# Altium project master.PrjPcb (part 1 of 2)
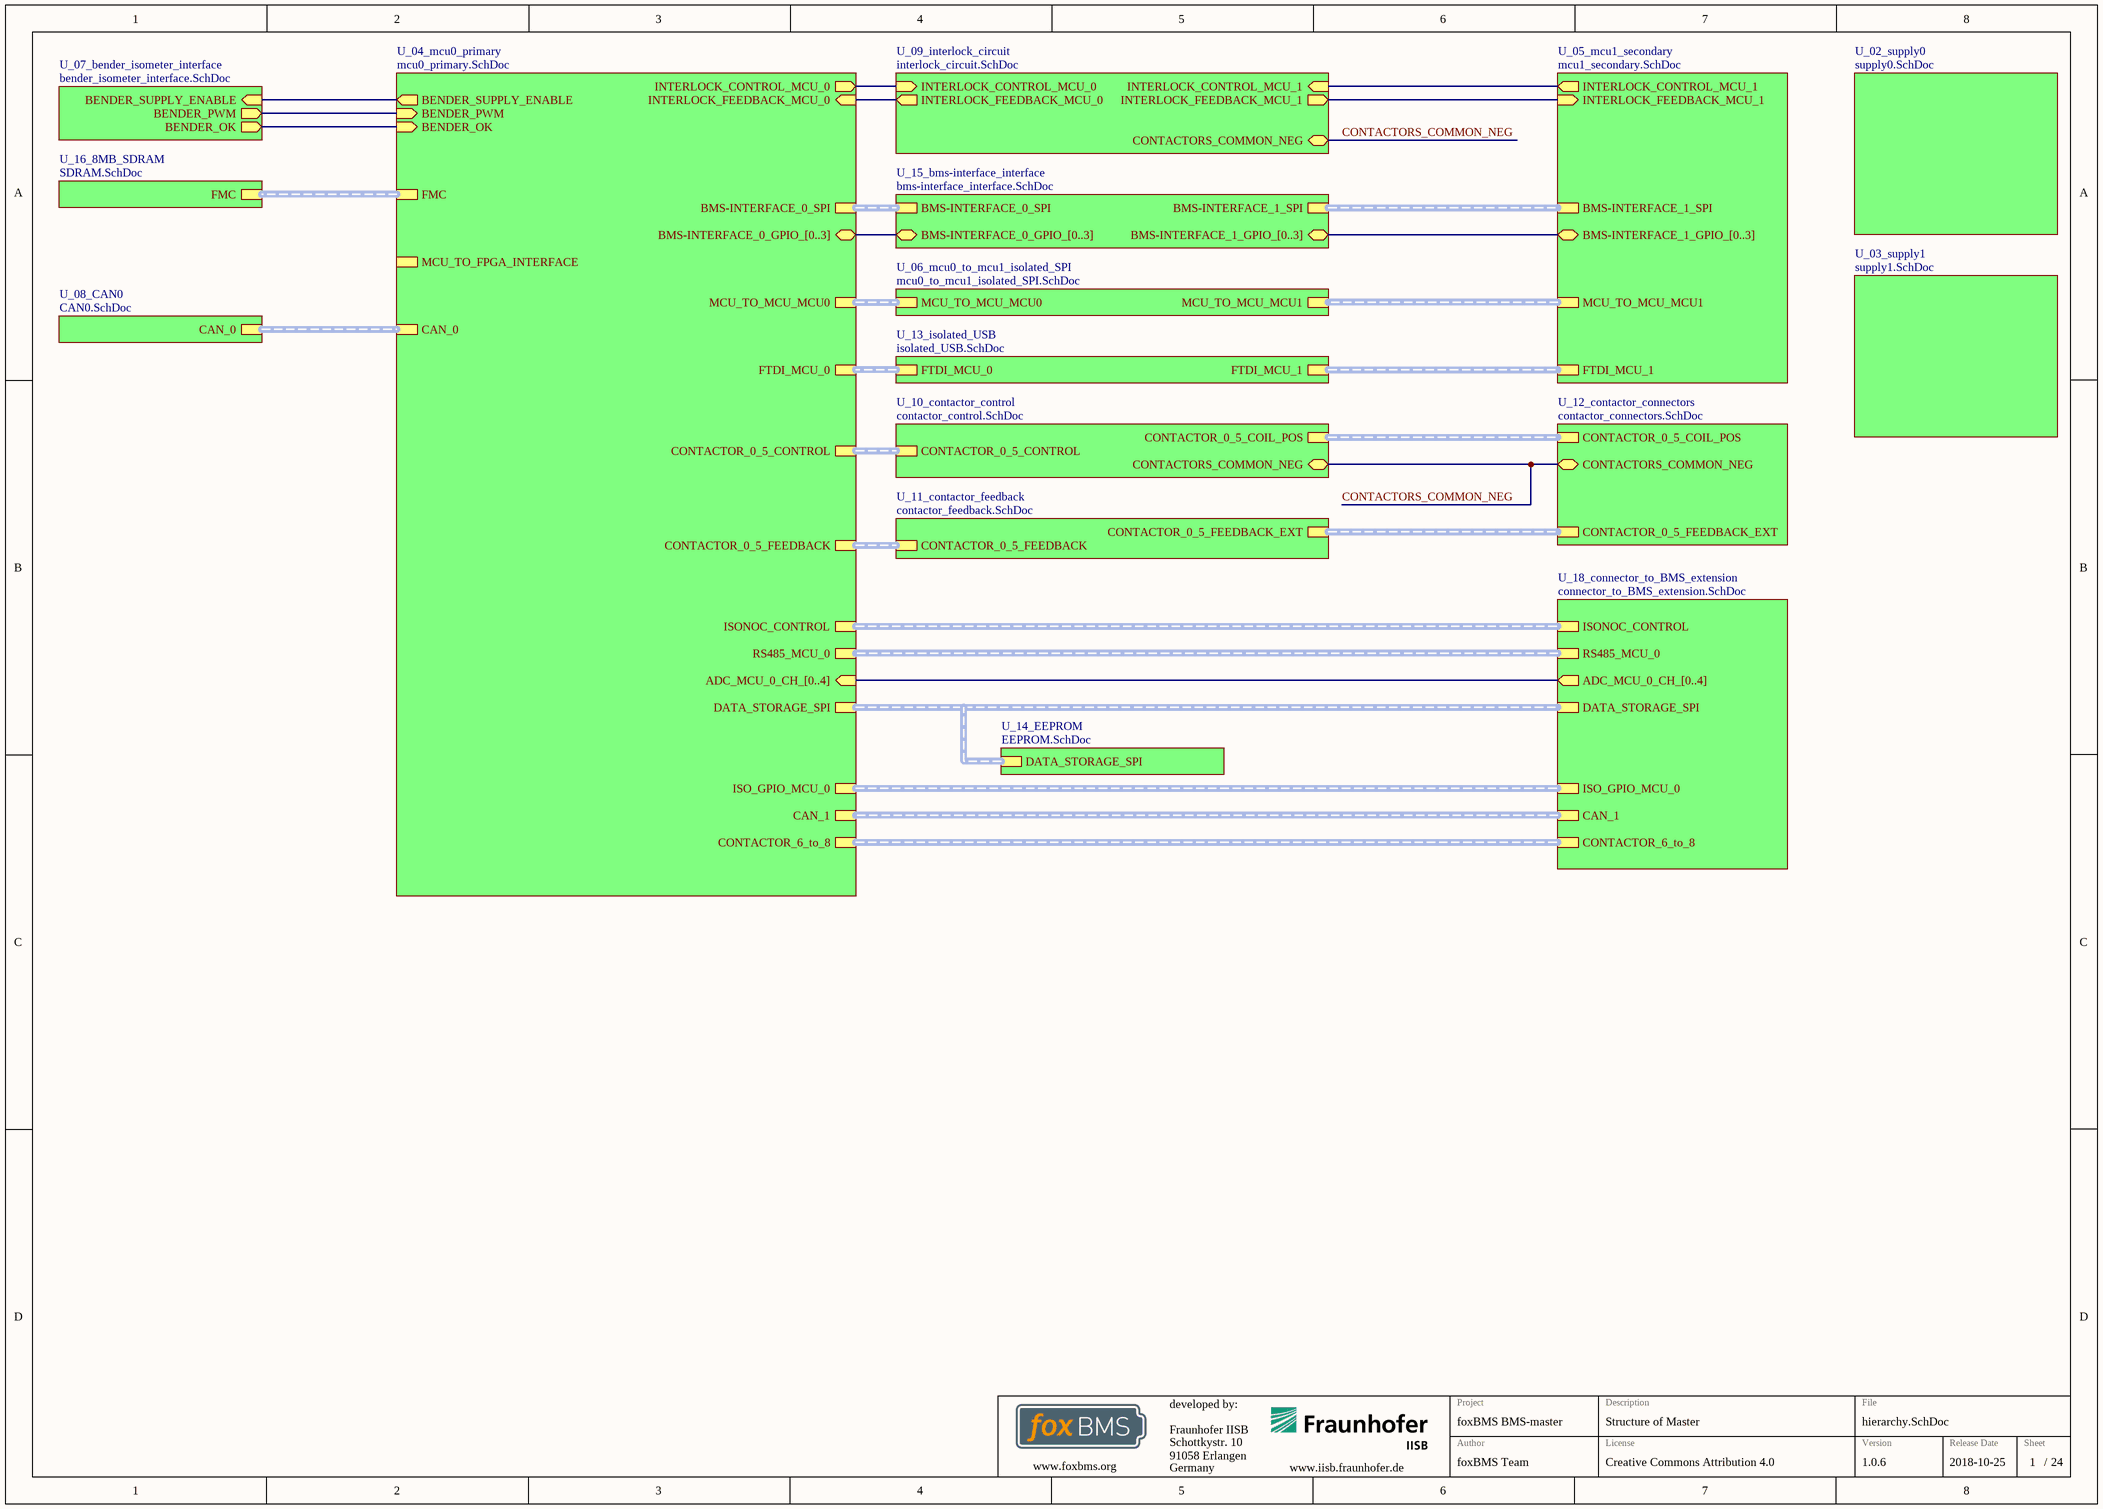
[diagram p0: hierarchy.SchDoc]
GlobalDate: 2018-10-25; GlobalLicense: Creative Commons Attribution 4.0; GlobalProject: foxBMS BMS-master; GlobalVersion: 1.0.6
8 sheets, 124 parts. Net scope: hierarchical (ports join the sheet entries above them; power ports are global).
Board file: master.PcbDoc
Sheets:
  hierarchy.SchDoc
    U_04_mcu0_primary = mcu0_primary.SchDoc
    U_07_bender_isometer_interface = bender_isometer_interface.SchDoc
    U_13_isolated_USB = isolated_USB.SchDoc
    U_05_mcu1_secondary = mcu1_secondary.SchDoc
    U_10_contactor_control = contactor_control.SchDoc
    U_11_contactor_feedback = contactor_feedback.SchDoc
    U_12_contactor_connectors = contactor_connectors.SchDoc

## Sheet hierarchy.SchDoc
size A3; DocumentNumber: 1; SheetNumber: 1; SheetTotal: 24; SheetDescription: Structure of Master

### Sub-sheets
U_02_supply0 = supply0.SchDoc (file not in this document): no entries
U_03_supply1 = supply1.SchDoc (file not in this document): no entries
U_04_mcu0_primary = mcu0_primary.SchDoc: MCU_TO_FPGA_INTERFACE (harness SPI), FMC (harness FMC), CAN_1 (harness CAN), CAN_0 (harness CAN), MCU_TO_MCU_MCU0 (harness SPI), BENDER_SUPPLY_ENABLE (out), BENDER_PWM (in), BENDER_OK (in), FTDI_MCU_0 (harness FTDI), CONTACTOR_6_to_8 (harness CONTACTOR_6_to_8), INTERLOCK_FEEDBACK_MCU_0 (in), INTERLOCK_CONTROL_MCU_0 (out), DATA_STORAGE_SPI (harness DATA_STORAGE_SPI), CONTACTOR_0_5_FEEDBACK (harness CONTACTOR_0_TO_5), CONTACTOR_0_5_CONTROL (harness CONTACTOR_0_TO_5), BMS-INTERFACE_0_SPI (harness SPI), BMS-INTERFACE_0_GPIO_[0..3] (bidir, harness CAN), ADC_MCU_0_CH_[0..4] (in), RS485_MCU_0 (harness RS485), ISONOC_CONTROL (harness ISONOC_CONTROL), ISO_GPIO_MCU_0 (harness ISO_GPIO)
U_05_mcu1_secondary = mcu1_secondary.SchDoc: INTERLOCK_FEEDBACK_MCU_1 (in), INTERLOCK_CONTROL_MCU_1 (out), FTDI_MCU_1 (harness FTDI), MCU_TO_MCU_MCU1 (harness SPI), BMS-INTERFACE_1_SPI (harness SPI), BMS-INTERFACE_1_GPIO_[0..3] (bidir)
U_06_mcu0_to_mcu1_isolated_SPI = mcu0_to_mcu1_isolated_SPI.SchDoc (file not in this document): MCU_TO_MCU_MCU0 (harness SPI), MCU_TO_MCU_MCU1 (harness SPI)
U_07_bender_isometer_interface = bender_isometer_interface.SchDoc: BENDER_SUPPLY_ENABLE (in), BENDER_OK (out), BENDER_PWM (out)
U_08_CAN0 = CAN0.SchDoc (file not in this document): CAN_0 (harness CAN)
U_09_interlock_circuit = interlock_circuit.SchDoc (file not in this document): INTERLOCK_CONTROL_MCU_1 (in), INTERLOCK_FEEDBACK_MCU_0 (out), INTERLOCK_FEEDBACK_MCU_1 (out), CONTACTORS_COMMON_NEG (bidir), INTERLOCK_CONTROL_MCU_0 (in)
U_10_contactor_control = contactor_control.SchDoc: CONTACTORS_COMMON_NEG (bidir), CONTACTOR_0_5_COIL_POS (harness CONTACTOR_0_TO_5), CONTACTOR_0_5_CONTROL (harness CONTACTOR_0_TO_5)
U_11_contactor_feedback = contactor_feedback.SchDoc: CONTACTOR_0_5_FEEDBACK_EXT (harness CONTACTOR_0_TO_5), CONTACTOR_0_5_FEEDBACK (harness CONTACTOR_0_TO_5)
U_12_contactor_connectors = contactor_connectors.SchDoc: CONTACTORS_COMMON_NEG (bidir), CONTACTOR_0_5_COIL_POS (harness CONTACTOR_0_TO_5), CONTACTOR_0_5_FEEDBACK_EXT (harness CONTACTOR_0_TO_5)
U_13_isolated_USB = isolated_USB.SchDoc: FTDI_MCU_0 (harness FTDI), FTDI_MCU_1 (harness FTDI)
U_14_EEPROM = EEPROM.SchDoc (file not in this document): DATA_STORAGE_SPI (harness DATA_STORAGE_SPI)
U_15_bms-interface_interface = bms-interface_interface.SchDoc (file not in this document): BMS-INTERFACE_0_SPI (harness SPI), BMS-INTERFACE_1_SPI (harness SPI), BMS-INTERFACE_0_GPIO_[0..3] (bidir), BMS-INTERFACE_1_GPIO_[0..3] (bidir)
U_16_8MB_SDRAM = SDRAM.SchDoc (file not in this document): FMC (harness FMC)
U_18_connector_to_BMS_extension = connector_to_BMS_extension.SchDoc (file not in this document): CAN_1 (harness CAN), CONTACTOR_6_to_8 (harness CONTACTOR_6_to_8), DATA_STORAGE_SPI (harness DATA_STORAGE_SPI), ADC_MCU_0_CH_[0..4] (out), RS485_MCU_0 (harness RS485), ISONOC_CONTROL (harness ISONOC_CONTROL), ISO_GPIO_MCU_0 (harness ISO_GPIO)

### Nets
BENDER_OK: sheet U_04_mcu0_primary/BENDER_OK, sheet U_07_bender_isometer_interface/BENDER_OK
BENDER_PWM: sheet U_04_mcu0_primary/BENDER_PWM, sheet U_07_bender_isometer_interface/BENDER_PWM
BENDER_SUPPLY_ENABLE: sheet U_04_mcu0_primary/BENDER_SUPPLY_ENABLE, sheet U_07_bender_isometer_interface/BENDER_SUPPLY_ENABLE
CONTACTORS_COMMON_NEG: sheet U_09_interlock_circuit/CONTACTORS_COMMON_NEG, sheet U_10_contactor_control/CONTACTORS_COMMON_NEG, sheet U_12_contactor_connectors/CONTACTORS_COMMON_NEG
INTERLOCK_CONTROL_MCU_0: sheet U_04_mcu0_primary/INTERLOCK_CONTROL_MCU_0, sheet U_09_interlock_circuit/INTERLOCK_CONTROL_MCU_0
INTERLOCK_CONTROL_MCU_1: sheet U_05_mcu1_secondary/INTERLOCK_CONTROL_MCU_1, sheet U_09_interlock_circuit/INTERLOCK_CONTROL_MCU_1
INTERLOCK_FEEDBACK_MCU_0: sheet U_04_mcu0_primary/INTERLOCK_FEEDBACK_MCU_0, sheet U_09_interlock_circuit/INTERLOCK_FEEDBACK_MCU_0
INTERLOCK_FEEDBACK_MCU_1: sheet U_05_mcu1_secondary/INTERLOCK_FEEDBACK_MCU_1, sheet U_09_interlock_circuit/INTERLOCK_FEEDBACK_MCU_1

### Buses and harness runs
bus sheet U_04_mcu0_primary/ADC_MCU_0_CH_[0..4] = sheet U_18_connector_to_BMS_extension/ADC_MCU_0_CH_[0..4]
bus sheet U_05_mcu1_secondary/BMS-INTERFACE_1_GPIO_[0..3] = sheet U_15_bms-interface_interface/BMS-INTERFACE_1_GPIO_[0..3]
harness sheet U_04_mcu0_primary/BMS-INTERFACE_0_SPI = sheet U_15_bms-interface_interface/BMS-INTERFACE_0_SPI
harness sheet U_04_mcu0_primary/CAN_0 = sheet U_08_CAN0/CAN_0
harness sheet U_04_mcu0_primary/CAN_1 = sheet U_18_connector_to_BMS_extension/CAN_1
harness sheet U_04_mcu0_primary/CONTACTOR_0_5_CONTROL = sheet U_10_contactor_control/CONTACTOR_0_5_CONTROL
harness sheet U_04_mcu0_primary/CONTACTOR_0_5_FEEDBACK = sheet U_11_contactor_feedback/CONTACTOR_0_5_FEEDBACK
harness sheet U_04_mcu0_primary/CONTACTOR_6_to_8 = sheet U_18_connector_to_BMS_extension/CONTACTOR_6_to_8
harness sheet U_04_mcu0_primary/DATA_STORAGE_SPI = sheet U_14_EEPROM/DATA_STORAGE_SPI = sheet U_18_connector_to_BMS_extension/DATA_STORAGE_SPI
harness sheet U_04_mcu0_primary/FMC = sheet U_16_8MB_SDRAM/FMC
harness sheet U_04_mcu0_primary/FTDI_MCU_0 = sheet U_13_isolated_USB/FTDI_MCU_0
harness sheet U_04_mcu0_primary/ISO_GPIO_MCU_0 = sheet U_18_connector_to_BMS_extension/ISO_GPIO_MCU_0
harness sheet U_04_mcu0_primary/ISONOC_CONTROL = sheet U_18_connector_to_BMS_extension/ISONOC_CONTROL
harness sheet U_04_mcu0_primary/MCU_TO_MCU_MCU0 = sheet U_06_mcu0_to_mcu1_isolated_SPI/MCU_TO_MCU_MCU0
harness sheet U_04_mcu0_primary/RS485_MCU_0 = sheet U_18_connector_to_BMS_extension/RS485_MCU_0
harness sheet U_05_mcu1_secondary/BMS-INTERFACE_1_SPI = sheet U_15_bms-interface_interface/BMS-INTERFACE_1_SPI
harness sheet U_05_mcu1_secondary/FTDI_MCU_1 = sheet U_13_isolated_USB/FTDI_MCU_1
harness sheet U_05_mcu1_secondary/MCU_TO_MCU_MCU1 = sheet U_06_mcu0_to_mcu1_isolated_SPI/MCU_TO_MCU_MCU1
harness sheet U_10_contactor_control/CONTACTOR_0_5_COIL_POS = sheet U_12_contactor_connectors/CONTACTOR_0_5_COIL_POS
harness sheet U_11_contactor_feedback/CONTACTOR_0_5_FEEDBACK_EXT = sheet U_12_contactor_connectors/CONTACTOR_0_5_FEEDBACK_EXT

### Notes on the sheet
- Fraunhofer IISB
- Schottkystr. 10
- developed by:
- 91058 Erlangen
- Germany
- Author
- Project
- License
- Description
- File
- Version
- Release Date
- Sheet
- www.foxbms.org
- www.iisb.fraunhofer.de
- foxBMS Team
- /

## Sheet mcu0_primary.SchDoc: foxBMS BMS-Master
size A3; DocumentNumber: 4; SheetNumber: 4; SheetTotal: 24; Author: Fraunhofer IISB foxBMS Team; REL-DATE: 2017-05-16; VERSION: 1.0.2; SheetDescription: MCU0 (Primary)
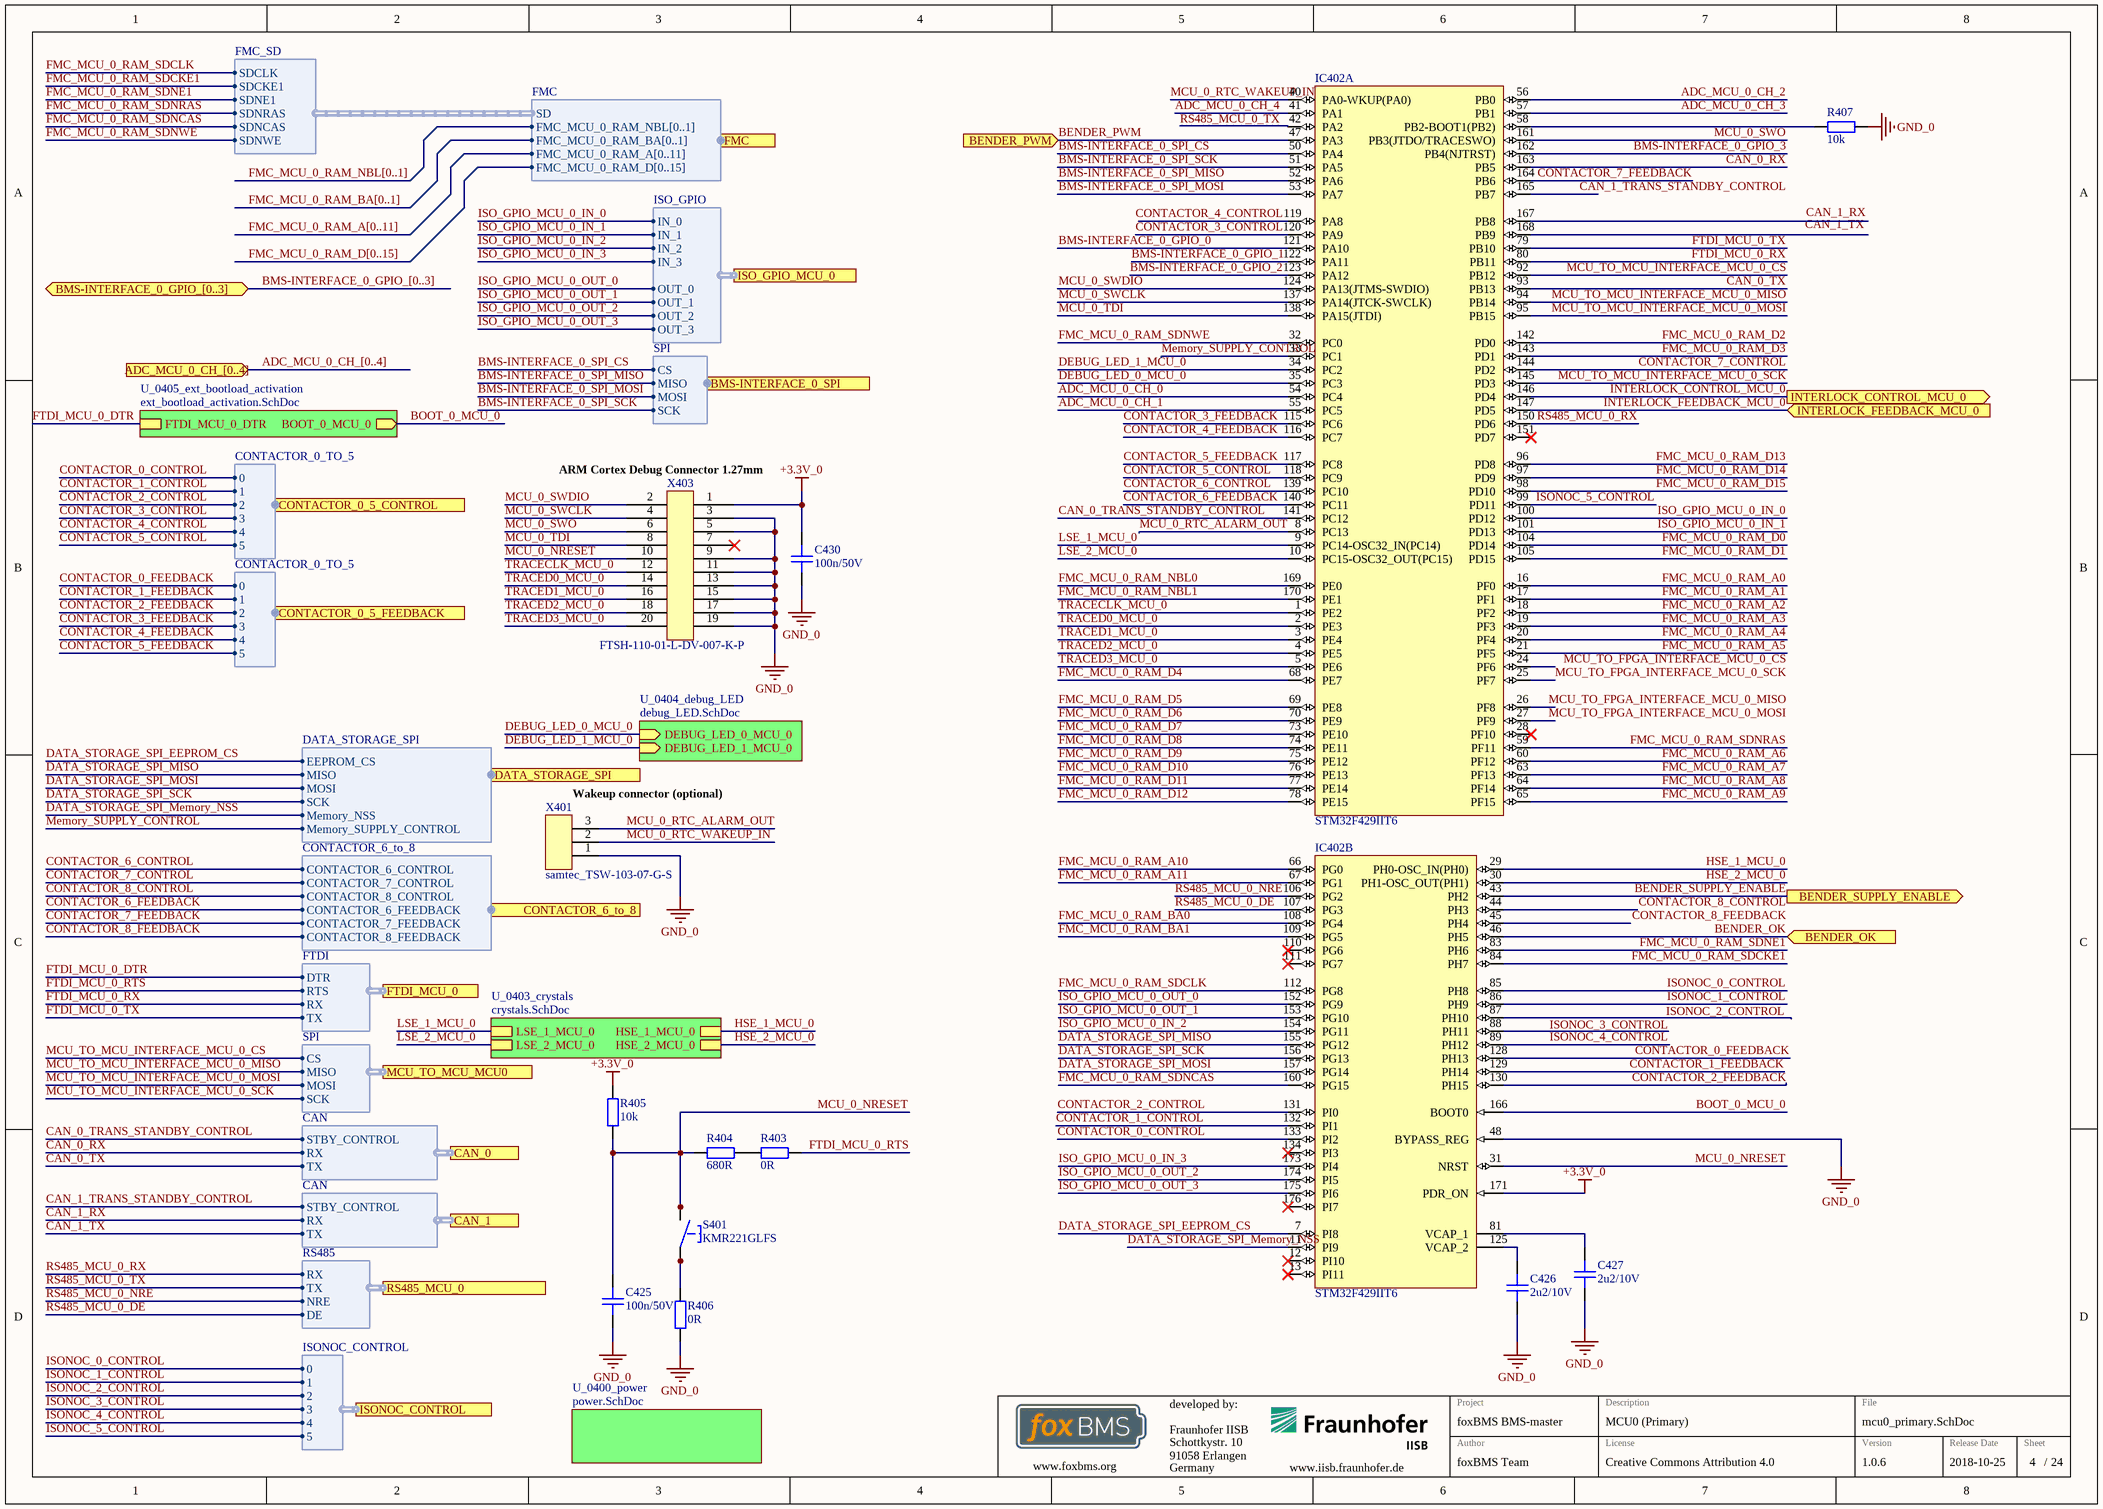
[diagram p1: mcu0_primary.SchDoc]

### Parts
C425  100n/50V  [CAPC1608X08N]
C426  2u2/10V  [CAPC1608X08N]
C427  2u2/10V  [CAPC1608X08N]
C430  100n/50V  [CAPC1608X08N]
IC402  STM32F429IIT6  [STM-LQFP176_N]  (parts A,B of 3)
R403  0R  [RESC1608X05N]
R404  680R  [RESC1608X05N]
R405  10k  [RESC1608X05N]
R406  0R  [RESC1608X05N]
R407  10k  [RESC1608X05N]
S401  KMR221GLFS  [KMR2_Series]
X401  samtec_TSW-103-07-G-S  [Pinheader_2.54_3]
X403  FTSH-110-01-L-DV-007-K-P  [CORTEX_DEBUG_20_PIN]

### Sub-sheets
U_0400_power = power.SchDoc (file not in this document): no entries
U_0403_crystals = crystals.SchDoc (file not in this document): LSE_1_MCU_0, LSE_2_MCU_0, HSE_1_MCU_0, HSE_2_MCU_0
U_0404_debug_LED = debug_LED.SchDoc (file not in this document): DEBUG_LED_0_MCU_0 (in), DEBUG_LED_1_MCU_0 (in)
U_0405_ext_bootload_activation = ext_bootload_activation.SchDoc (file not in this document): FTDI_MCU_0_DTR, BOOT_0_MCU_0 (out)

### Ports
ADC_MCU_0_CH_[0..4] (in), BENDER_OK (in), BENDER_PWM (in), BENDER_SUPPLY_ENABLE (out), BMS-INTERFACE_0_GPIO_[0..3] (bidir, harness CAN), BMS-INTERFACE_0_SPI (harness SPI), CAN_0 (harness CAN), CAN_1 (harness CAN), CONTACTOR_0_5_CONTROL (harness CONTACTOR_0_TO_5), CONTACTOR_0_5_FEEDBACK (harness CONTACTOR_0_TO_5), CONTACTOR_6_to_8 (harness CONTACTOR_6_to_8), DATA_STORAGE_SPI (harness DATA_STORAGE_SPI), FMC (harness FMC), FTDI_MCU_0 (harness FTDI), INTERLOCK_CONTROL_MCU_0 (out), INTERLOCK_FEEDBACK_MCU_0 (in), ISO_GPIO_MCU_0 (harness ISO_GPIO), ISONOC_CONTROL (harness ISONOC_CONTROL), MCU_TO_MCU_MCU0 (harness SPI), RS485_MCU_0 (harness RS485)

### Harnesses
FMC_SD: SDCLK, SDCKE1, SDNE1, SDNRAS, SDNWE, SDNCAS
FMC: SD, FMC_MCU_0_RAM_NBL[0..1], FMC_MCU_0_RAM_BA[0..1], FMC_MCU_0_RAM_A[0..11], FMC_MCU_0_RAM_D[0..15]
DATA_STORAGE_SPI: EEPROM_CS, MISO, MOSI, SCK, Memory_NSS, Memory_SUPPLY_CONTROL
CONTACTOR_6_to_8: CONTACTOR_6_CONTROL, CONTACTOR_7_CONTROL, CONTACTOR_8_CONTROL, CONTACTOR_6_FEEDBACK, CONTACTOR_7_FEEDBACK, CONTACTOR_8_FEEDBACK
SPI: CS, MISO, MOSI, SCK
FTDI: DTR, RTS, RX, TX
CAN: STBY_CONTROL, RX, TX
RS485: RX, TX, NRE, DE
ISONOC_CONTROL: 0, 1, 2, 3, 4, 5
ISO_GPIO: IN_0, IN_1, IN_2, IN_3, OUT_3, OUT_0, OUT_1, OUT_2
CONTACTOR_0_TO_5: 0, 1, 2, 3, 4, 5

### Nets
+3.3V_0: C430.1 IC402.171(PDR_ON) R405.2 X403.1
GND_0: C425.2 C426.2 C427.2 C430.2 IC402.48(BYPASS_REG) R406.1 R407.1 X401.1 X403.3 X403.5 X403.9 X403.11 X403.13 X403.15 X403.17 X403.19
ADC_MCU_0_CH_0: IC402.54(PC4)
ADC_MCU_0_CH_1: IC402.55(PC5)
ADC_MCU_0_CH_2: IC402.56(PB0)
ADC_MCU_0_CH_3: IC402.57(PB1)
ADC_MCU_0_CH_4: IC402.41(PA1)
BENDER_OK: IC402.46(PH5) ; port BENDER_OK
BENDER_PWM: IC402.47(PA3) ; port BENDER_PWM
BENDER_SUPPLY_ENABLE: IC402.43(PH2) ; port BENDER_SUPPLY_ENABLE
BMS-INTERFACE_0_GPIO_0: IC402.121(PA10)
BMS-INTERFACE_0_GPIO_1: IC402.122(PA11)
BMS-INTERFACE_0_GPIO_2: IC402.123(PA12)
BMS-INTERFACE_0_GPIO_3: IC402.162(PB4(NJTRST))
BMS-INTERFACE_0_SPI_CS: IC402.50(PA4) ; port BMS-INTERFACE_0_SPI.CS
BMS-INTERFACE_0_SPI_MISO: IC402.52(PA6) ; port BMS-INTERFACE_0_SPI.MISO
BMS-INTERFACE_0_SPI_MOSI: IC402.53(PA7) ; port BMS-INTERFACE_0_SPI.MOSI
BMS-INTERFACE_0_SPI_SCK: IC402.51(PA5) ; port BMS-INTERFACE_0_SPI.SCK
BOOT_0_MCU_0: IC402.166(BOOT0) ; sheet U_0405_ext_bootload_activation/BOOT_0_MCU_0
CAN_0_RX: IC402.163(PB5) ; port CAN_0.RX
CAN_0_TRANS_STANDBY_CONTROL: IC402.141(PC12) ; port CAN_0.STBY_CONTROL
CAN_0_TX: IC402.93(PB13) ; port CAN_0.TX
CAN_1_RX: port CAN_1.RX
CAN_1_TRANS_STANDBY_CONTROL: port CAN_1.STBY_CONTROL
CAN_1_TX: port CAN_1.TX
CONTACTOR_0_CONTROL: IC402.133(PI2) ; port CONTACTOR_0_5_CONTROL.0
CONTACTOR_0_FEEDBACK: IC402.128(PH13) ; port CONTACTOR_0_5_FEEDBACK.0
CONTACTOR_1_CONTROL: IC402.132(PI1) ; port CONTACTOR_0_5_CONTROL.1
CONTACTOR_1_FEEDBACK: IC402.129(PH14) ; port CONTACTOR_0_5_FEEDBACK.1
CONTACTOR_2_CONTROL: IC402.131(PI0) ; port CONTACTOR_0_5_CONTROL.2
CONTACTOR_3_CONTROL: IC402.120(PA9) ; port CONTACTOR_0_5_CONTROL.3
CONTACTOR_3_FEEDBACK: IC402.115(PC6) ; port CONTACTOR_0_5_FEEDBACK.3
CONTACTOR_4_CONTROL: port CONTACTOR_0_5_CONTROL.4
CONTACTOR_4_FEEDBACK: IC402.116(PC7) ; port CONTACTOR_0_5_FEEDBACK.4
CONTACTOR_5_CONTROL: IC402.118(PC9) ; port CONTACTOR_0_5_CONTROL.5
CONTACTOR_5_FEEDBACK: IC402.117(PC8) ; port CONTACTOR_0_5_FEEDBACK.5
CONTACTOR_6_CONTROL: IC402.139(PC10) ; port CONTACTOR_6_to_8.CONTACTOR_6_CONTROL
CONTACTOR_6_FEEDBACK: IC402.140(PC11) ; port CONTACTOR_6_to_8.CONTACTOR_6_FEEDBACK
CONTACTOR_7_CONTROL: IC402.144(PD2) ; port CONTACTOR_6_to_8.CONTACTOR_7_CONTROL
CONTACTOR_7_FEEDBACK: IC402.164(PB6) ; port CONTACTOR_6_to_8.CONTACTOR_7_FEEDBACK
CONTACTOR_8_CONTROL: port CONTACTOR_6_to_8.CONTACTOR_8_CONTROL
CONTACTOR_8_FEEDBACK: port CONTACTOR_6_to_8.CONTACTOR_8_FEEDBACK
DATA_STORAGE_SPI_EEPROM_CS: IC402.7(PI8) ; port DATA_STORAGE_SPI.EEPROM_CS
DATA_STORAGE_SPI_Memory_NSS: IC402.11(PI9) ; port DATA_STORAGE_SPI.Memory_NSS
DATA_STORAGE_SPI_MISO: IC402.155(PG12) ; port DATA_STORAGE_SPI.MISO
DATA_STORAGE_SPI_MOSI: IC402.157(PG14) ; port DATA_STORAGE_SPI.MOSI
DATA_STORAGE_SPI_SCK: IC402.156(PG13) ; port DATA_STORAGE_SPI.SCK
DEBUG_LED_0_MCU_0: IC402.35(PC3) ; sheet U_0404_debug_LED/DEBUG_LED_0_MCU_0
DEBUG_LED_1_MCU_0: IC402.34(PC2) ; sheet U_0404_debug_LED/DEBUG_LED_1_MCU_0
FMC_MCU_0_RAM_A0: IC402.16(PF0)
FMC_MCU_0_RAM_A1: IC402.17(PF1)
FMC_MCU_0_RAM_A2: IC402.18(PF2)
FMC_MCU_0_RAM_A3: IC402.19(PF3)
FMC_MCU_0_RAM_A4: IC402.20(PF4)
FMC_MCU_0_RAM_A5: IC402.21(PF5)
FMC_MCU_0_RAM_A6: IC402.60(PF12)
FMC_MCU_0_RAM_A7: IC402.63(PF13)
FMC_MCU_0_RAM_A8: IC402.64(PF14)
FMC_MCU_0_RAM_A9: IC402.65(PF15)
FMC_MCU_0_RAM_A10: IC402.66(PG0)
FMC_MCU_0_RAM_A11: IC402.67(PG1)
FMC_MCU_0_RAM_BA0: IC402.108(PG4)
FMC_MCU_0_RAM_BA1: IC402.109(PG5)
FMC_MCU_0_RAM_D0: IC402.104(PD14)
FMC_MCU_0_RAM_D1: IC402.105(PD15)
FMC_MCU_0_RAM_D2: IC402.142(PD0)
FMC_MCU_0_RAM_D3: IC402.143(PD1)
FMC_MCU_0_RAM_D4: IC402.68(PE7)
FMC_MCU_0_RAM_D5: IC402.69(PE8)
FMC_MCU_0_RAM_D6: IC402.70(PE9)
FMC_MCU_0_RAM_D7: IC402.73(PE10)
FMC_MCU_0_RAM_D8: IC402.74(PE11)
FMC_MCU_0_RAM_D9: IC402.75(PE12)
FMC_MCU_0_RAM_D10: IC402.76(PE13)
FMC_MCU_0_RAM_D11: IC402.77(PE14)
FMC_MCU_0_RAM_D12: IC402.78(PE15)
FMC_MCU_0_RAM_D13: IC402.96(PD8)
FMC_MCU_0_RAM_D14: IC402.97(PD9)
FMC_MCU_0_RAM_D15: IC402.98(PD10)
FMC_MCU_0_RAM_NBL0: IC402.169(PE0)
FMC_MCU_0_RAM_NBL1: IC402.170(PE1)
FMC_MCU_0_RAM_SDCKE1: IC402.84(PH7) ; harness FMC_SD.SDCKE1
FMC_MCU_0_RAM_SDCLK: IC402.112(PG8) ; harness FMC_SD.SDCLK
FMC_MCU_0_RAM_SDNCAS: IC402.160(PG15) ; harness FMC_SD.SDNCAS
FMC_MCU_0_RAM_SDNE1: IC402.83(PH6) ; harness FMC_SD.SDNE1
FMC_MCU_0_RAM_SDNRAS: IC402.59(PF11) ; harness FMC_SD.SDNRAS
FMC_MCU_0_RAM_SDNWE: IC402.32(PC0) ; harness FMC_SD.SDNWE
FTDI_MCU_0_DTR: sheet U_0405_ext_bootload_activation/FTDI_MCU_0_DTR, port FTDI_MCU_0.DTR
FTDI_MCU_0_RTS: R403.2 ; port FTDI_MCU_0.RTS
FTDI_MCU_0_RX: IC402.80(PB11) ; port FTDI_MCU_0.RX
FTDI_MCU_0_TX: IC402.79(PB10) ; port FTDI_MCU_0.TX
HSE_1_MCU_0: IC402.29(PH0-OSC_IN(PH0)) ; sheet U_0403_crystals/HSE_1_MCU_0
HSE_2_MCU_0: IC402.30(PH1-OSC_OUT(PH1)) ; sheet U_0403_crystals/HSE_2_MCU_0
INTERLOCK_CONTROL_MCU_0: IC402.146(PD4) ; port INTERLOCK_CONTROL_MCU_0
INTERLOCK_FEEDBACK_MCU_0: IC402.147(PD5) ; port INTERLOCK_FEEDBACK_MCU_0
ISO_GPIO_MCU_0_IN_0: IC402.100(PD12) ; port ISO_GPIO_MCU_0.IN_0
ISO_GPIO_MCU_0_IN_1: IC402.101(PD13) ; port ISO_GPIO_MCU_0.IN_1
ISO_GPIO_MCU_0_IN_2: IC402.154(PG11) ; port ISO_GPIO_MCU_0.IN_2
ISO_GPIO_MCU_0_IN_3: IC402.173(PI4) ; port ISO_GPIO_MCU_0.IN_3
ISO_GPIO_MCU_0_OUT_0: IC402.152(PG9) ; port ISO_GPIO_MCU_0.OUT_0
ISO_GPIO_MCU_0_OUT_1: IC402.153(PG10) ; port ISO_GPIO_MCU_0.OUT_1
ISO_GPIO_MCU_0_OUT_2: IC402.174(PI5) ; port ISO_GPIO_MCU_0.OUT_2
ISO_GPIO_MCU_0_OUT_3: IC402.175(PI6) ; port ISO_GPIO_MCU_0.OUT_3
ISONOC_0_CONTROL: IC402.85(PH8) ; port ISONOC_CONTROL.0
ISONOC_1_CONTROL: IC402.86(PH9) ; port ISONOC_CONTROL.1
ISONOC_2_CONTROL: port ISONOC_CONTROL.2
ISONOC_3_CONTROL: port ISONOC_CONTROL.3
ISONOC_4_CONTROL: IC402.89(PH12) ; port ISONOC_CONTROL.4
ISONOC_5_CONTROL: IC402.99(PD11) ; port ISONOC_CONTROL.5
LSE_1_MCU_0: IC402.9(PC14-OSC32_IN(PC14)) ; sheet U_0403_crystals/LSE_1_MCU_0
LSE_2_MCU_0: IC402.10(PC15-OSC32_OUT(PC15)) ; sheet U_0403_crystals/LSE_2_MCU_0
MCU_0_NRESET: C425.1 IC402.31(NRST) R404.1 R405.1 S401.3 S401.4 X403.10
MCU_0_RTC_ALARM_OUT: IC402.8(PC13) X401.3
MCU_0_RTC_WAKEUP_IN: IC402.40(PA0-WKUP(PA0)) X401.2
MCU_0_SWCLK: IC402.137(PA14(JTCK-SWCLK)) X403.4
MCU_0_SWDIO: IC402.124(PA13(JTMS-SWDIO)) X403.2
MCU_0_SWO: IC402.161(PB3(JTDO/TRACESWO)) X403.6
MCU_0_TDI: IC402.138(PA15(JTDI)) X403.8
MCU_TO_MCU_INTERFACE_MCU_0_CS: IC402.92(PB12) ; port MCU_TO_MCU_MCU0.CS
MCU_TO_MCU_INTERFACE_MCU_0_MISO: IC402.94(PB14) ; port MCU_TO_MCU_MCU0.MISO
MCU_TO_MCU_INTERFACE_MCU_0_MOSI: IC402.95(PB15) ; port MCU_TO_MCU_MCU0.MOSI
MCU_TO_MCU_INTERFACE_MCU_0_SCK: IC402.145(PD3) ; port MCU_TO_MCU_MCU0.SCK
Memory_SUPPLY_CONTROL: IC402.33(PC1) ; port DATA_STORAGE_SPI.Memory_SUPPLY_CONTROL
RS485_MCU_0_DE: IC402.107(PG3) ; port RS485_MCU_0.DE
RS485_MCU_0_NRE: IC402.106(PG2) ; port RS485_MCU_0.NRE
RS485_MCU_0_RX: IC402.150(PD6) ; port RS485_MCU_0.RX
RS485_MCU_0_TX: port RS485_MCU_0.TX
TRACECLK_MCU_0: IC402.1(PE2) X403.12
TRACED0_MCU_0: IC402.2(PE3) X403.14
TRACED1_MCU_0: IC402.3(PE4) X403.16
TRACED2_MCU_0: IC402.4(PE5) X403.18
TRACED3_MCU_0: IC402.5(PE6) X403.20
NetC426_1: C426.1 IC402.125(VCAP_2)
NetC427_1: C427.1 IC402.81(VCAP_1)
NetIC402_58: IC402.58(PB2-BOOT1(PB2)) R407.2
NetR403_1: R403.1 R404.2
NetR406_2: R406.2 S401.1 S401.2

Not connected (* = marked no-connect by the designer): IC402 12(PI10)* 13(PI11)* 24(PF6) 25(PF7) 26(PF8) 27(PF9) 28(PF10)* 42(PA2) 44(PH3) 45(PH4) 87(PH10) 88(PH11) 110(PG6)* 111(PG7)* 119(PA8) 130(PH15) 134(PI3)* 151(PD7)* 165(PB7) 167(PB8) 168(PB9) 176(PI7)*; X403 7*

### Buses and harness runs
bus ADC_MCU_0_CH_[0..4] = port ADC_MCU_0_CH_[0..4]
bus BMS-INTERFACE_0_GPIO_[0..3]
bus FMC_MCU_0_RAM_A[0..11]
bus FMC_MCU_0_RAM_BA[0..1]
bus FMC_MCU_0_RAM_D[0..15]
bus FMC_MCU_0_RAM_NBL[0..1]

### Notes on the sheet
- (near X403) ARM Cortex Debug Connector 1.27mm
- (near X401) Wakeup connector (optional)
- Labels drawn without touching a wire or pin: CAN_1_RX, CAN_1_TRANS_STANDBY_CONTROL, CAN_1_TX, CONTACTOR_2_FEEDBACK, CONTACTOR_4_CONTROL, CONTACTOR_8_CONTROL, CONTACTOR_8_FEEDBACK, ISONOC_2_CONTROL, ISONOC_3_CONTROL, MCU_TO_FPGA_INTERFACE_MCU_0_CS, MCU_TO_FPGA_INTERFACE_MCU_0_MISO, MCU_TO_FPGA_INTERFACE_MCU_0_MOSI, MCU_TO_FPGA_INTERFACE_MCU_0_SCK, RS485_MCU_0_TX
- Fraunhofer IISB
- Schottkystr. 10
- developed by:
- 91058 Erlangen
- Germany
- Author
- Project
- License
- Description
- File
- Version
- Release Date
- Sheet
- www.foxbms.org
- www.iisb.fraunhofer.de
- foxBMS Team
- /

### Library data of the parts
C425 C430 = gen_C_ceramic_100n_50V_X7R_0603: MLCC; Capacitance: 100n; Rated Voltage: 50V; Dielectric: X7R; Case EIA: 0603; Case Metric: 1608; PnP Package: C_0603_10; PnP Value: 100n/50V/X7R; PnP equipped: x; Automotive Qualified: False; Part Number: gen_C_ceramic_100n_50V_X7R_0603; Supplier 1: Farnell; Supplier Part Number 1: 2525267; Supplier 2: Digikey; Supplier Part Number 2: 490-6049-1-ND
C426 C427 = gen_C_ceramic_2u2_10V_X5R_0603: MLCC; Capacitance: 2u2; Rated Voltage: 10V; Dielectric: X5R; Case EIA: 0603; Case Metric: 1608; AVT Set: x; Automotive Qualified: False; Part Number: gen_C_ceramic_2u2_10V_X5R_0603; Supplier 1: Farnell; Supplier Part Number 1: 2320817
IC402 = CMP-0243-00078-2: ARM Cortex-M4 32-bit MCU+FPU, 225 DMIPS, 2048 kB Flash, 256 kB Internal RAM, 140 I/Os, 176-pin LQFP, -40 to 85 degC, Tray; Manufacturer: STMicroelectronics; Internal RAM Size (kB): 256; I/Os (High Current): 140; FLASH Size (Prog) (kB): 2048; D/A Converter: 2x12-bit; Supply Voltage(Vcc) max (V): 3.6; Operating Frequency(F) (Processor speed) (MHz): 180; Supply Voltage(Vcc) min (V): 1.8; Core: ARM Cortex-M4; PackageReference: LQFP176; ComponentLink1Description: Manufacturer URL; Packing: Tray; ComponentLink2Description: Datasheet; ComponentLink3Description: Package Specification; ComponentLink2URL: http://www.st.com/st-web-ui/static/active/en/resource/technical/document/data_brief/DM00053488.pdf; PackageVersion: Rev. 4, 06/2013; ComponentLink1URL: http://www.st.com/web/en/home.html; DatasheetVersion: Rev. 2; PartNumber: STM32F429IIT6; PackageDescription: 176-Pin Low Profile Quad Flat Package, 24 x 24 mm Body, 0.5 mm Pitch; ComponentLink3URL: http://www.st.com/st-web-ui/static/active/en/resource/technical/document/datasheet/DM00035129.pdf; Mounting Technology: Surface Mount
R403 R406 = gen_R_0R_0603: SMD Resistor 0R 0603; Power: 0.1W; Case EIA: 0603; Case Metric: 1608; PnP Package: R_0603; Maximum Working Voltage: 75V; Automotive Qualified: False; Part Number: gen_R_0R_0603; Operating Temperature: -55°C - +155°C; Resistance: 0R; Series: Jumper; PnP Value: 0R; Supplier 1: Farnell; Supplier Part Number 1: 2073345
R404 = gen_R_680R_0603: SMD Resistor 680R 0603; Tolerance: 1%; Power: 0.1W; Case EIA: 0603; Case Metric: 1608; Maximum Working Voltage: 75V; PnP Package: R_0603; Automotive Qualified: False; Part Number: gen_R_680R_0603; Operating Temperature: -55°C - +155°C; Resistance: 680R; Series: E24; PnP Value: 680R; Supplier 1: Farnell; Supplier Part Number 1: 2797303
R405 R407 = gen_R_10k_0603: SMD Resistor 10k 0603; Tolerance: 1%; Power: 0.1W; Case EIA: 0603; Case Metric: 1608; Maximum Working Voltage: 75V; PnP Package: R_0603; Automotive Qualified: False; Part Number: gen_R_10k_0603; Operating Temperature: -55°C - +155°C; Resistance: 10k; Series: E24, E96; PnP Value: 10k; Supplier 1: Farnell; Supplier Part Number 1: 2073349
S401 = KMR221GLFS: Microminiature Tactile Switch; Manufacturer: CK Components; Automotive Qualified: False; Part Number: KMR221GLFS; Operating Temperature: -40°C - +85°C; ComponentLink1Description: Datasheet; ComponentLink1URL: http://www.farnell.com/datasheets/1685525.pdf; Supplier 1: Farnell; Supplier Part Number 1: 1201424; Supplier 2: Digikey; Supplier Part Number 2: 401-1426-1-ND; Supplier 3: Mouser; Supplier Part Number 3: 611-KMR211G-LFS
X401 = samtec_TSW-103-07-G-S: Board-To-Board Connector, Vertical, 2.54 mm, 3 Contacts, Header, TSW Series, Through Hole, 1 Row; Manufacturer: Samtec; Circuits: 3; Automotive Qualified: False; Part Number: samtec_TSW-103-07-G-S; Part Name: TSW-103-07-G-S; Operating Temperature: -55°C - +125°C; ComponentLink1Description: Datasheet; ComponentLink1URL: http://www.farnell.com/datasheets/1796313.pdf; Supplier 1: Farnell; Supplier Part Number 1: 2505045
X403 = samtec_FTSH-110-01-L-DV-007-K-P: Board-To-Board Connector, ARM Cortex Debug Header 20 Pin; Manufacturer: Samtec; Circuits: 20; Automotive Qualified: False; Part Number: samtec_FTSH-110-01-L-DV-007-K-P; Part Name: FTSH-110-01-L-DV-007-K-P; Operating Temperature: -55°C - +125°C; Supplier 1: Digikey; Supplier Part Number 1: SAM11268-ND; Supplier 2: Avnet; Supplier Part Number 2: FTSH-110-01-L-DV-007-K-P

## Sheet bender_isometer_interface.SchDoc: foxBMS BMS-Master
size A3; DocumentNumber: 13; SheetNumber: 13; SheetTotal: 24; Author: Fraunhofer IISB foxBMS Team; REL-DATE: 2017-05-16; VERSION: 1.0.2; SheetDescription: Bender Isometer Interface
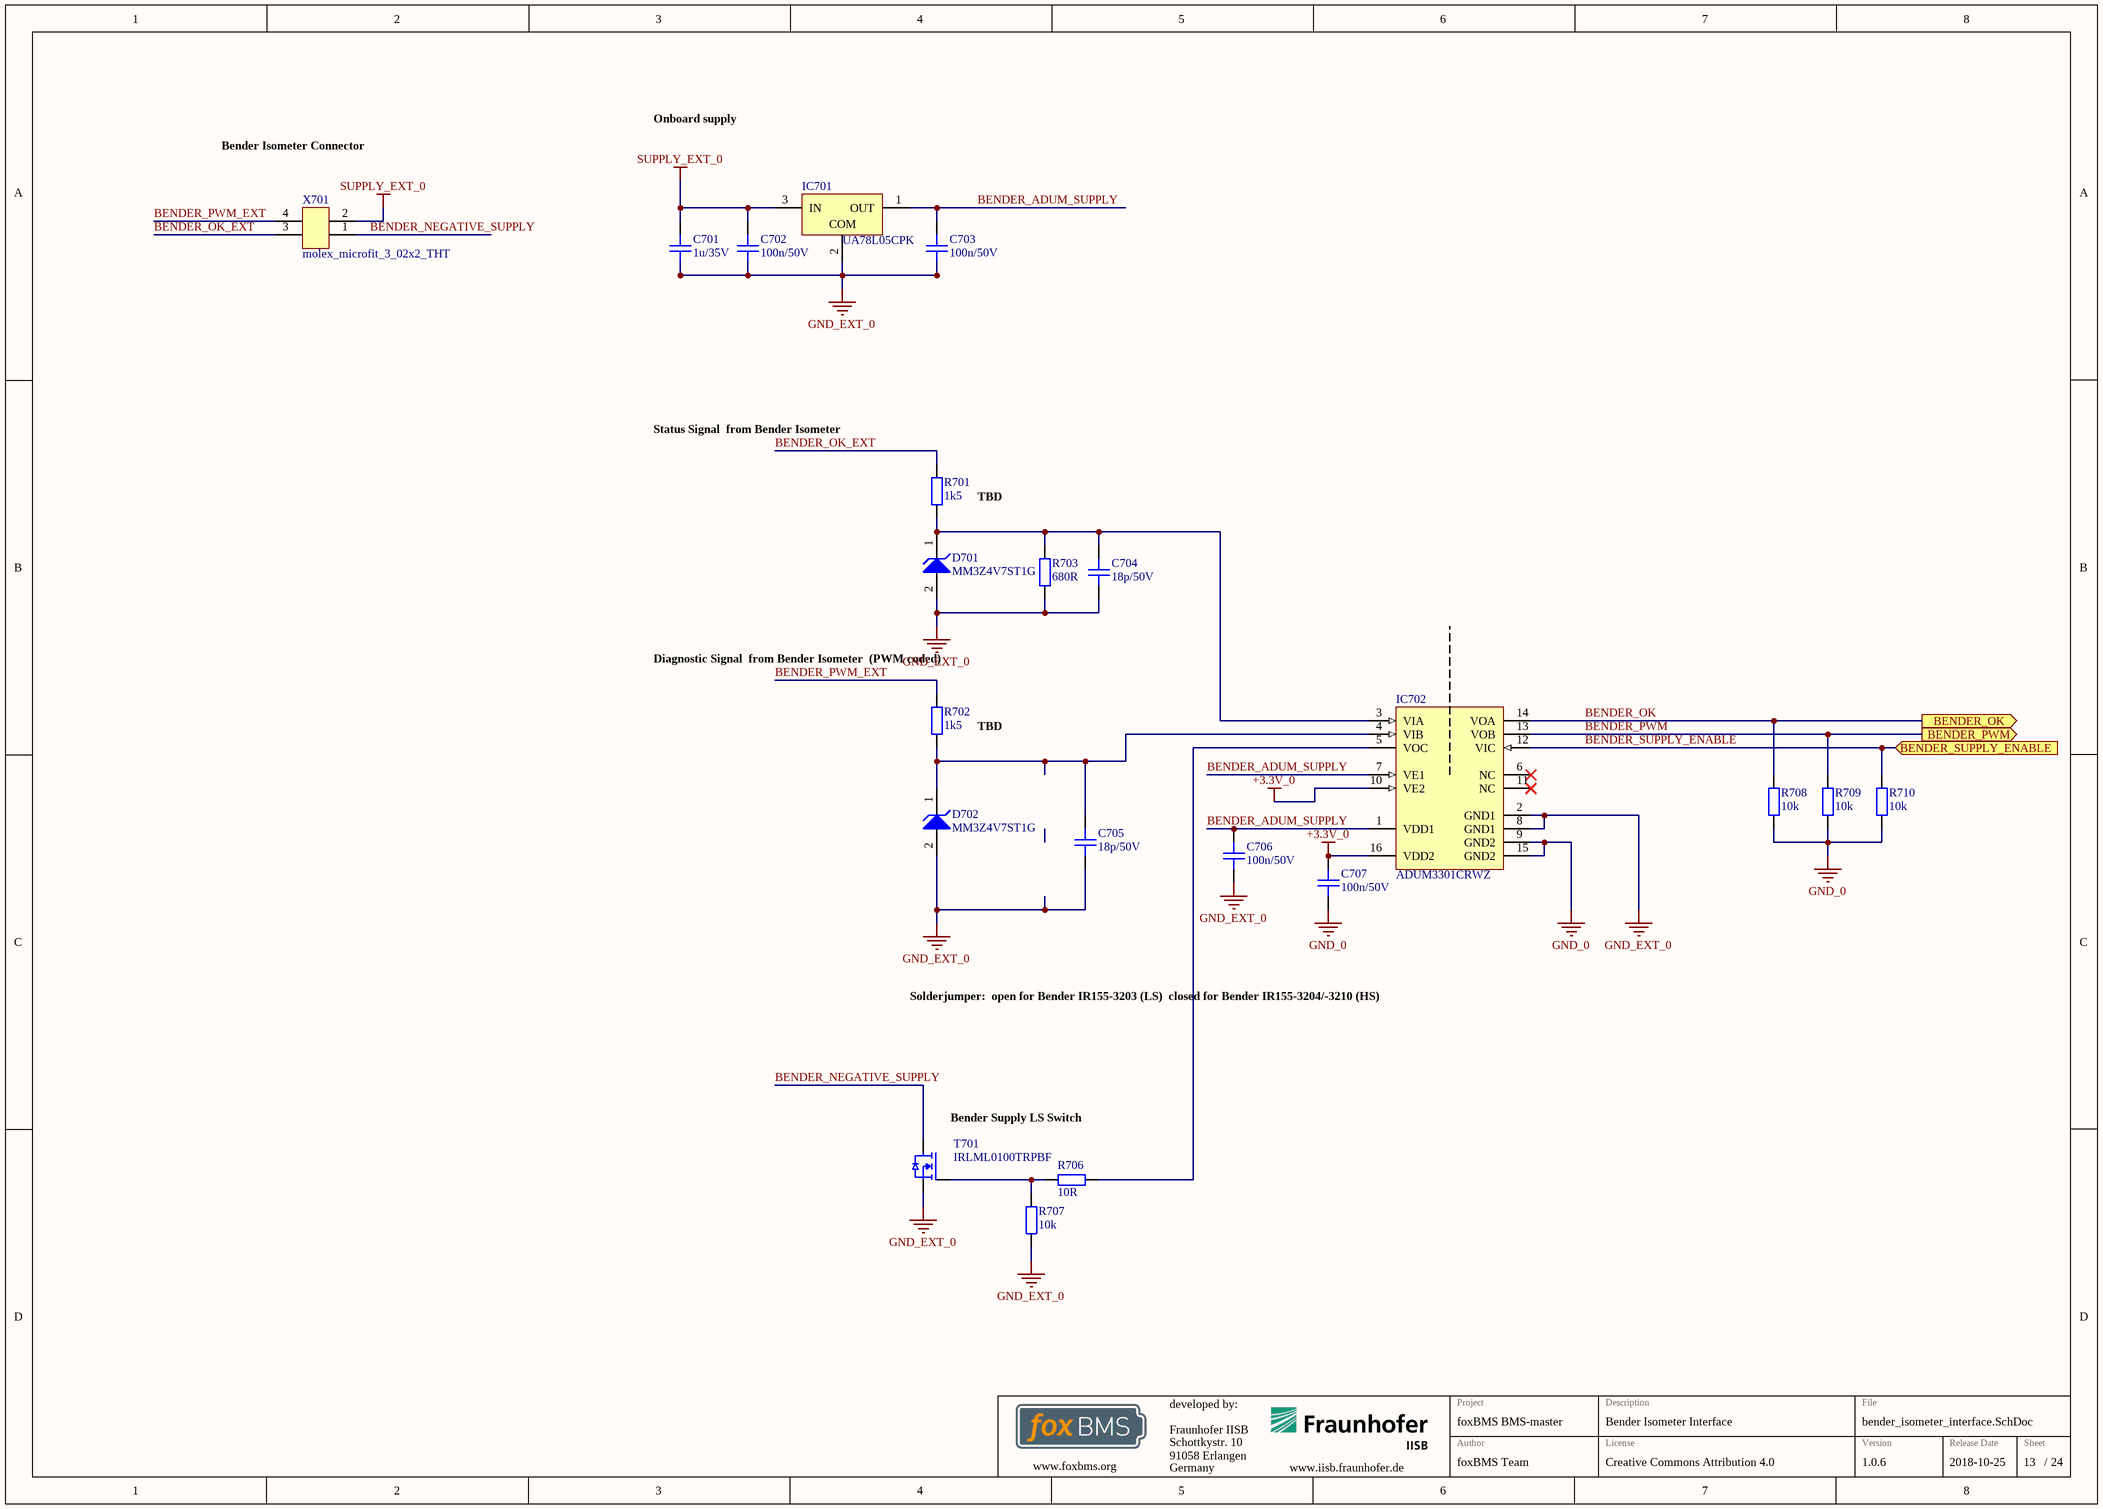
[diagram p2: bender_isometer_interface.SchDoc]

### Parts
C701  1u/35V  [CAPC1608X08N]
C702  100n/50V  [CAPC1608X08N]
C703  100n/50V  [CAPC1608X08N]
C704  18p/50V  [CAPC1608X08N]
C705  18p/50V  [CAPC1608X08N]
C706  100n/50V  [CAPC1608X08N]
C707  100n/50V  [CAPC1608X08N]
D701  MM3Z4V7ST1G  [ONSC-SOD-323-2-477-02_V]
D702  MM3Z4V7ST1G  [ONSC-SOD-323-2-477-02_V]
IC701  UA78L05CPK  [PK0003A_L]
IC702  ADUM3301CRWZ  [ADI-RW-16_N]
R701  1k5  [RESC1608X05N]
R702  1k5  [RESC1608X05N]
R703  680R  [RESC1608X05N]
R706  10R  [RESC1608X05N]
R707  10k  [RESC1608X05N]
R708  10k  [RESC1608X05N]
R709  10k  [RESC1608X05N]
R710  10k  [RESC1608X05N]
T701  IRLML0100TRPBF  [SOT95P237X110-3N]
X701  molex_microfit_3_02x2_THT  [MOLEX_MICROFIT_02x2_THT]

### Ports
BENDER_OK (out), BENDER_PWM (out), BENDER_SUPPLY_ENABLE (in)

### Nets
+3.3V_0: C707.1 IC702.10(VE2) IC702.16(VDD2)
GND_0: C707.2 IC702.9(GND2) IC702.15(GND2) R708.1 R709.1 R710.1
GND_EXT_0: C701.2 C702.2 C703.2 C704.2 C705.2 C706.2 D701.2(A) D702.2(A) IC701.2(COM) IC702.2(GND1) IC702.8(GND1) R703.1 R707.2 T701.S
SUPPLY_EXT_0: C701.1 C702.1 IC701.3(IN) X701.2
BENDER_ADUM_SUPPLY: C703.1 C706.1 IC701.1(OUT) IC702.1(VDD1) IC702.7(VE1)
BENDER_NEGATIVE_SUPPLY: T701.D X701.1
BENDER_OK: IC702.14(VOA) R708.2 ; port BENDER_OK
BENDER_OK_EXT: R701.2 X701.3
BENDER_PWM: IC702.13(VOB) R709.2 ; port BENDER_PWM
BENDER_PWM_EXT: R702.2 X701.4
BENDER_SUPPLY_ENABLE: IC702.12(VIC) R710.2 ; port BENDER_SUPPLY_ENABLE
NetC704_1: C704.1 D701.1(K) IC702.3(VIA) R701.1 R703.2
NetC705_1: C705.1 D702.1(K) IC702.4(VIB) R702.1
NetIC702_5: IC702.5(VOC) R706.1
NetR706_2: R706.2 R707.1 T701.G

Not connected (* = marked no-connect by the designer): IC702 6(NC)* 11(NC)*

### Notes on the sheet
- Bender Isometer Connector
- Onboard supply
- Status Signal
  from Bender Isometer
- (near R701) TBD
- (near R702) Diagnostic Signal
  from Bender Isometer
  (PWM coded)
- (near R702) TBD
- Solderjumper:
  open for Bender IR155-3203 (LS)
  closed for Bender IR155-3204/-3210 (HS)
- (near T701) Bender Supply LS Switch
- Fraunhofer IISB
- Schottkystr. 10
- developed by:
- 91058 Erlangen
- Germany
- Author
- Project
- License
- Description
- File
- Version
- Release Date
- Sheet
- www.foxbms.org
- www.iisb.fraunhofer.de
- foxBMS Team
- /

### Library data of the parts
C701 = gen_C_ceramic_1u_35V_X7R_0603: MLCC; Capacitance: 1u; Rated Voltage: 35V; Dielectric: X7R; Case EIA: 0603; Case Metric: 1608; PnP Package: C_0603_10; PnP Value: 1uF/35V/X7R; PnP equipped: x; Automotive Qualified: False; Part Number: gen_C_ceramic_1u_35V_X7R_0603; Supplier 1: Farnell; Supplier Part Number 1: 1907508
C702 C703 C706 C707 = gen_C_ceramic_100n_50V_X7R_0603: as C425 on sheet mcu0_primary; Part Number: gen_C_ceramic_100n_50V_X7R_0603; Supplier 1: Farnell; Supplier Part Number 1: 2525267; Supplier 2: Digikey; Supplier Part Number 2: 490-6049-1-ND
C704 C705 = gen_C_ceramic_18p_50V_C0G_0603: MLCC; Capacitance: 18p; Rated Voltage: 50V; Dielectric: C0G; Case EIA: 0603; Case Metric: 1608; Automotive Qualified: False; Part Number: gen_C_ceramic_18p_50V_C0G_0603; Supplier 1: Farnell; Supplier Part Number 1: 2070403
D701 D702 = CMP-1060-00697-1: Zener Voltage Regulator, 300 mW, Tight Tolerance Portfolio, 2-Pin SOD-323, Pb-Free, Tape and Reel; Manufacturer: On Semiconductor; P Max (W): 0.3; ComponentLink2Description: Datasheet; PackageDescription: 2-Pin SOD, Body 1.7 x 1.25 mm; PartNumber: MM3Z4V7ST1G; ComponentLink2URL: http://www.onsemi.cn/pub_link/Collateral/MM3Z2V4ST1-D.PDF; ComponentLink1Description: Manufacturer URL; DatasheetVersion: Rev. 21; PackageReference: SOD-323-2-477-02; ComponentLink3URL: http://www.onsemi.com/pub_link/Collateral/477-02.PDF.1; RoHS: Pb-Free; ComponentLink3Description: Package Specification; ComponentLink1URL: http://www.onsemi.com/; Packing: Tape and Reel; Mounting Technology: Surface Mount; PackageVersion: Rev. H, 03/2007
IC701 = CMP-2000-07341-1: Positive-Voltage Regulator, 100 mA, 0 to 125 degC, 3-Pin SOT-89 (PK), Green (RoHS & no Sb/Br), Tape and Reel; Manufacturer: TexasInstruments; Load Regulation: 60mV; Input Voltage MIN: 7V; Number of Outputs: 1; Input Voltage MAX: 20V; Output Type: Fixed; Output Current: 100mA; Output Voltage: 5V; PSRR / Ripple Rejection - Typ: 49dB; Line Regulation: 200mV; Mounting Style: SMD/SMT; Datasheet Version: Rev. U, 05/2011; Polarity: Positive; Minimum Operating Temperature: 0C; Package Reference: PK0003A; Brand: TexasInstruments; Packaging: Reel; Product Category: LinearVoltageRegulators; RoHS: True; Datasheet URL: http://www.ti.com/lit/ds/symlink/ua78l05.pdf; Package URL: http://www.ti.com/lit/ml/mhsi001b/mhsi001b.pdf; Series: UA78L05; Manufacturer URL: http://www.ti.com/; Package Description: 3-Pin Small Outline Transistor, Body 4.5 x 2.5 mm, Pitch 1.5 mm; Mounting Technology: SurfaceMount; Package / Case: SOT-89-4; Maximum Operating Temperature: +125C
IC702 = CMP-0534-00610-1: Triple Channel Digital Isolator, Enhanced System-Level ESD Reliability, 2.5 KV rms Insulation Rating, 90 Mbps Data Rate, 32 ns Delay, Industrial, 16-pin SOIC (RW-16), Tube; Manufacturer: Analog Devices; Insulation Rating (kVrms): 2.5; Max Data Rate: 90Mbps; PackageVersion: 032707-B, 03/2007; PartNumber: ADUM3301CRWZ; PackageDescription: 16-Pin Standard Small Outline Package, Body 10.3 x 7.5 mm, Pitch 1.27 mm; Max Operating Temp (degreesC): 105; PackageReference: RW-16; Code_JEDEC: MS-013-AA; ComponentLink1URL: http://www.analog.com/en/index.html; ComponentLink2URL: http://www.analog.com/static/imported-files/data_sheets/ADUM3300_3301.pdf; ComponentLink1Description: Manufacturer URL; ComponentLink4URL: Product URL:http://www.analog.com/en/interface-isolation/digital-isolators/adum3301/products/product.html; ComponentLink4Description: URL Link1; DatasheetVersion: Rev. B; ComponentLink3URL: http://www.analog.com/static/imported-files/packages/PKG_PDF/SOIC_WIDE%20%28RW%29/RW_16.pdf; ComponentLink3Description: Package Specification; Mounting Technology: Surface Mount; ComponentLink2Description: Datasheet
R701 R702 = gen_R_1k5_0603: SMD Resistor 1k5 0603; Tolerance: 1%; Power: 0.1W; Case EIA: 0603; Case Metric: 1608; Maximum Working Voltage: 75V; PnP Package: R_0603; Automotive Qualified: False; Part Number: gen_R_1k5_0603; Operating Temperature: -55°C - +155°C; Resistance: 1k5; Series: E24, E96; PnP Value: 1k5; Supplier 1: Farnell; Supplier Part Number 1: 2616745
R703 = gen_R_680R_0603: as R404 on sheet mcu0_primary; Part Number: gen_R_680R_0603; Operating Temperature: -55°C - +155°C; Resistance: 680R; Series: E24; PnP Value: 680R; Supplier 1: Farnell; Supplier Part Number 1: 2797303
R706 = gen_R_10R_0603: SMD Resistor 10R 0603; Tolerance: 1%; Power: 0.1W; Case EIA: 0603; Case Metric: 1608; Maximum Working Voltage: 75V; PnP Package: R_0603; Automotive Qualified: False; Part Number: gen_R_10R_0603; Operating Temperature: -55°C - +155°C; Resistance: 10R; Series: E24, E96; PnP Value: 10R; Supplier 1: Farnell; Supplier Part Number 1: 2073361
R707-R710 = gen_R_10k_0603: as R405 on sheet mcu0_primary; Part Number: gen_R_10k_0603; Operating Temperature: -55°C - +155°C; Resistance: 10k; Series: E24, E96; PnP Value: 10k; Supplier 1: Farnell; Supplier Part Number 1: 2073349
T701 = IRLML0100TRPBF: MOSFET-Transistor, n-Kanal, 1.6 A, 100 V, 0.178 ohm, 10 V, 2.5 V; Manufacturer: Infineon; Maximum Drain-Source Voltage: 100V; Maximum Continous Drain Current (25°C): 1.6A; R_DS(on): 190m; Total Gate Charge: 2.5nC; Automotive Qualified: False; Part Number: IRLML0100TRPBF; Part Name: NMOS; Operating Temperature: -55°C - +150°C; ComponentLink1Description: Datasheet URL; ComponentLink1URL: http://www.farnell.com/datasheets/491501.pdf; Supplier 1: Farnell; Supplier Part Number 1: 1783928
X701 = molex_microfit_3_02x2_THT: Micro-Fit 3.0 Right Angle Header, 3.00mm Pitch, Dual Row, 4 Circuits, with Snap-in Plastic Peg PCB Lock, Tin, Glow Wire Capable, Black, 43045-0400; Manufacturer: Molex; Circuits: 4; Rated Voltage: 600V; Rated Current: 8.5A; Automotive Qualified: False; Part Number: molex_microfit_3_02x2_THT; Part Name: MicroFit; Operating Temperature: -40°C - +105°C; Supplier 1: Farnell; Supplier Part Number 1: 9733019

## Sheet isolated_USB.SchDoc: foxBMS BMS-Master
size A3; DocumentNumber: 19; SheetNumber: 19; SheetTotal: 24; Author: Fraunhofer IISB foxBMS Team; REL-DATE: 2017-05-16; VERSION: 1.0.2; SheetDescription: Isolated USB MCU_0 + MCU_1
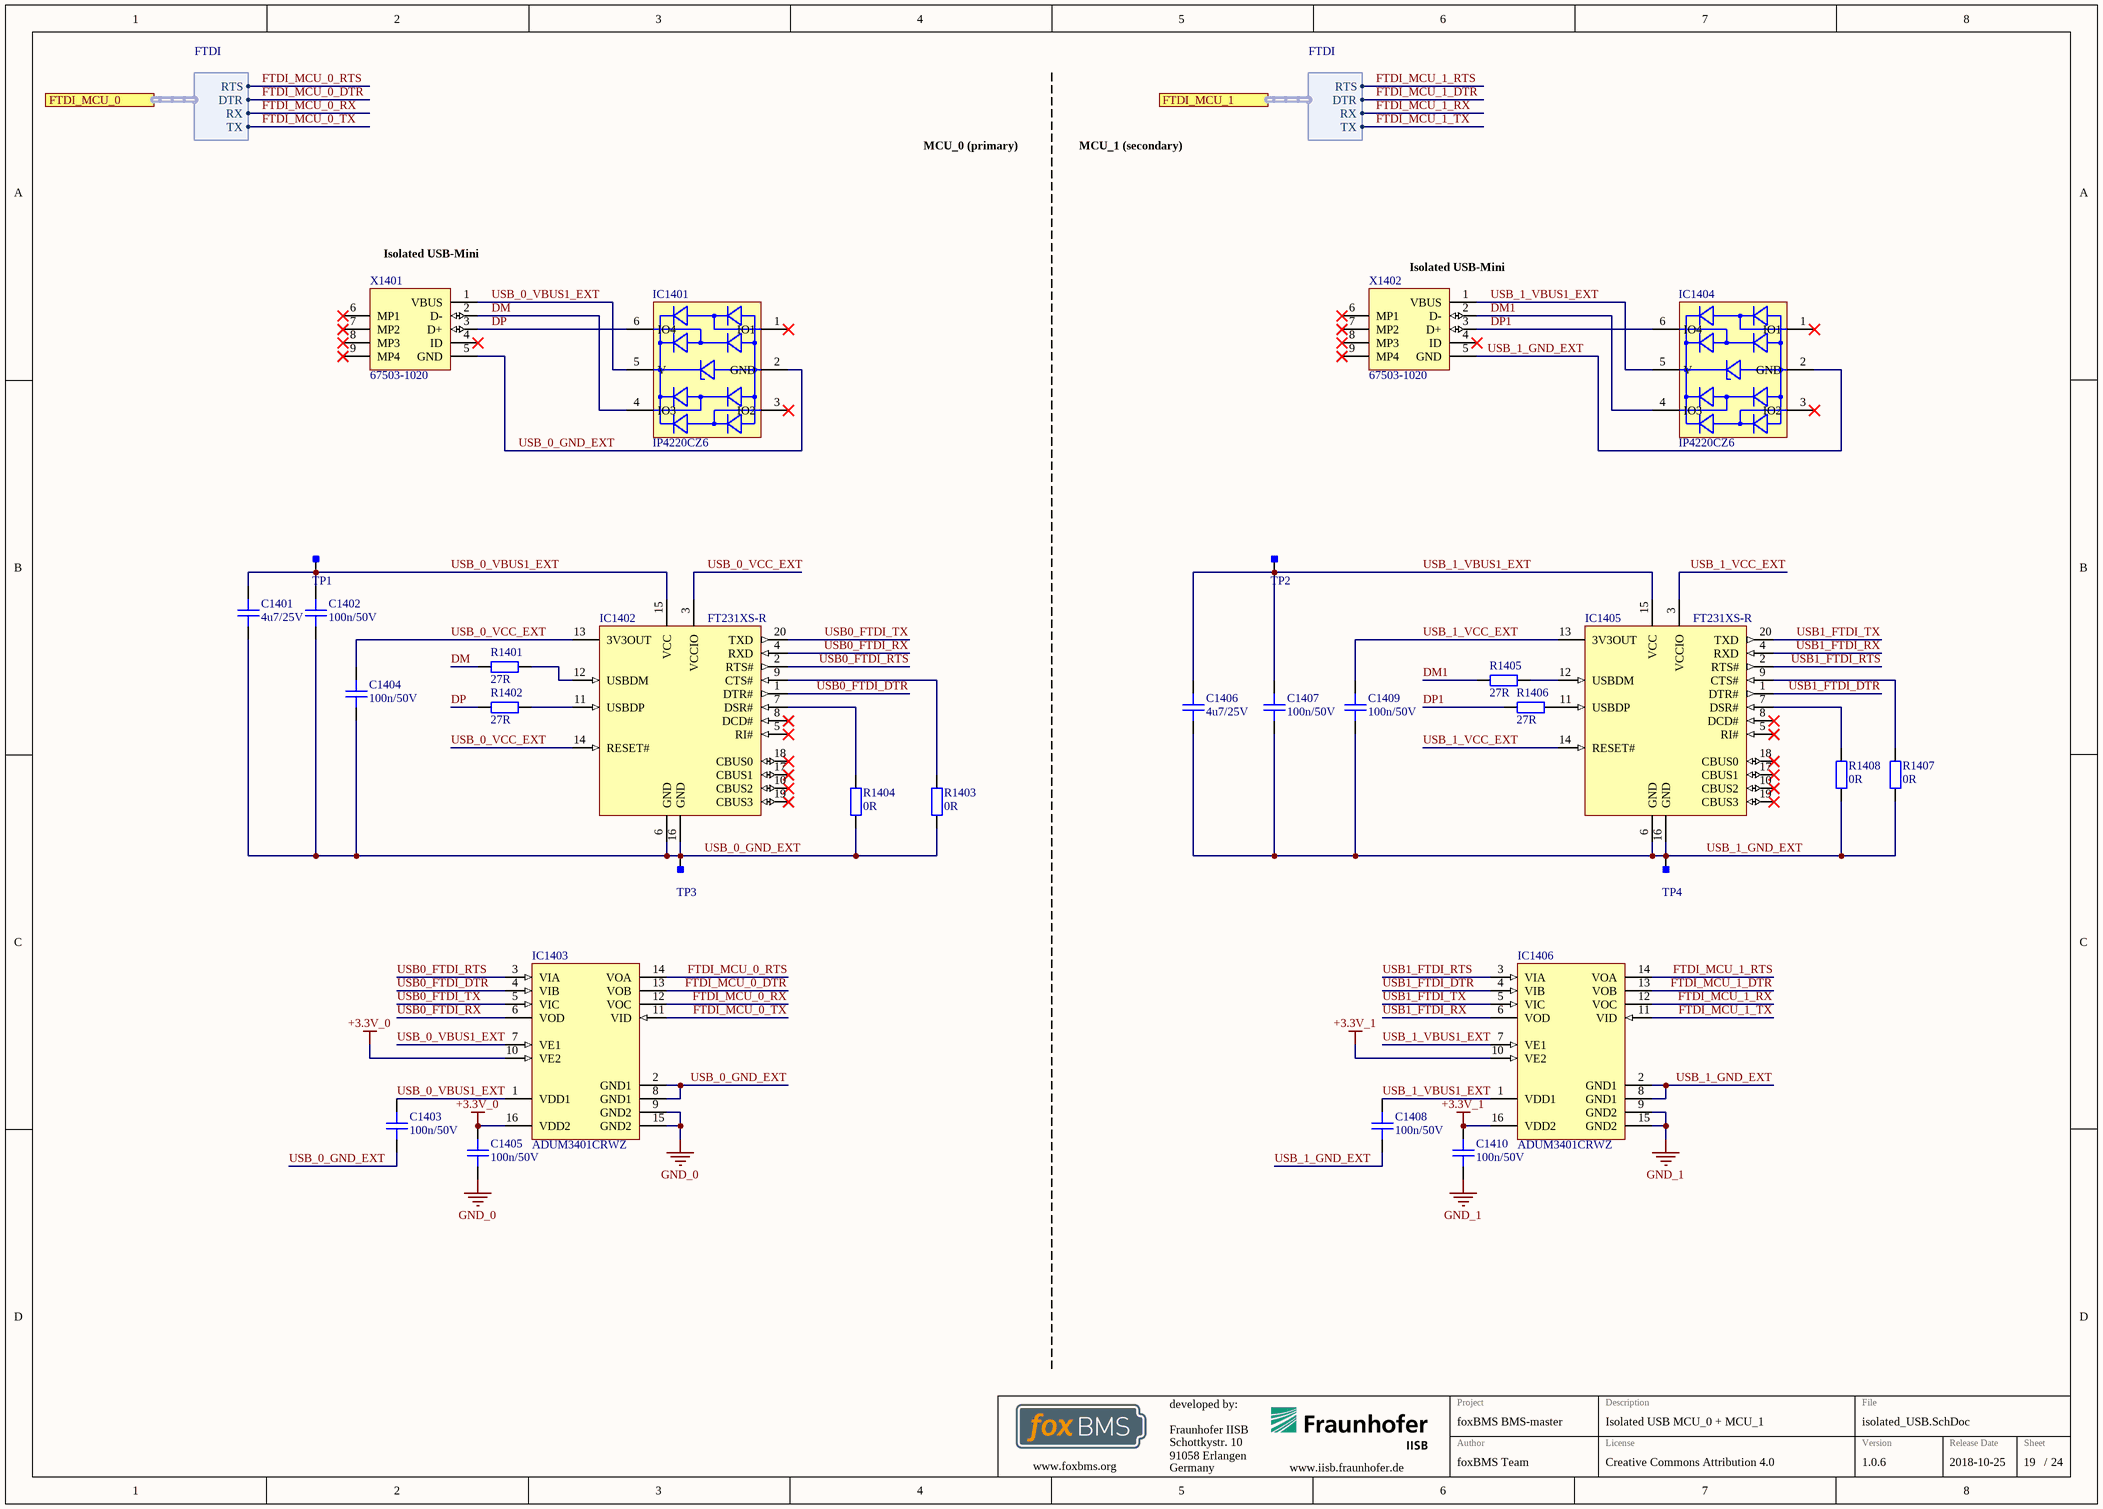
[diagram p3: isolated_USB.SchDoc]

### Parts
C1401  4u7/25V  [CAPC1608X08N]
C1402  100n/50V  [CAPC1608X08N]
C1403  100n/50V  [CAPC1608X08N]
C1404  100n/50V  [CAPC1608X08N]
C1405  100n/50V  [CAPC1608X08N]
C1406  4u7/25V  [CAPC1608X08N]
C1407  100n/50V  [CAPC1608X08N]
C1408  100n/50V  [CAPC1608X08N]
C1409  100n/50V  [CAPC1608X08N]
C1410  100n/50V  [CAPC1608X08N]
IC1401  IP4220CZ6  [TSOP95P280X110-6N]
IC1402  FT231XS-R  [SSOP-20_L]
IC1403  ADUM3401CRWZ  [ADI-RW-16_N]
IC1404  IP4220CZ6  [TSOP95P280X110-6N]
IC1405  FT231XS-R  [SSOP-20_L]
IC1406  ADUM3401CRWZ  [ADI-RW-16_N]
R1401  27R  [RESC1608X05N]
R1402  27R  [RESC1608X05N]
R1403  0R  [RESC1608X05N]
R1404  0R  [RESC1608X05N]
R1405  27R  [RESC1608X05N]
R1406  27R  [RESC1608X05N]
R1407  0R  [RESC1608X05N]
R1408  0R  [RESC1608X05N]
TP1  Testpoint_Square  [Testpoint_S1]  (value not drawn)  (no BOM)
TP2  Testpoint_Square  [Testpoint_S1]  (value not drawn)  (no BOM)
TP3  Testpoint_Square  [Testpoint_S1]  (value not drawn)  (no BOM)
TP4  Testpoint_Square  [Testpoint_S1]  (value not drawn)  (no BOM)
X1401  67503-1020  [MOLX-67503-1020_V]
X1402  67503-1020  [MOLX-67503-1020_V]

### Ports
FTDI_MCU_0 (harness FTDI), FTDI_MCU_1 (harness FTDI)

### Harnesses
FTDI: RTS, DTR, RX, TX

### Nets
+3.3V_0: C1405.1 IC1403.10(VE2) IC1403.16(VDD2)
+3.3V_1: C1410.1 IC1406.10(VE2) IC1406.16(VDD2)
GND_0: C1405.2 IC1403.9(GND2) IC1403.15(GND2)
GND_1: C1410.2 IC1406.9(GND2) IC1406.15(GND2)
DM: IC1401.4(IO3) R1401.2 X1401.2(D-)
DM1: IC1404.4(IO3) R1405.2 X1402.2(D-)
DP: IC1401.6(IO4) R1402.2 X1401.3(D+)
DP1: IC1404.6(IO4) R1406.2 X1402.3(D+)
FTDI_MCU_0_DTR: IC1403.13(VOB) ; port FTDI_MCU_0.DTR
FTDI_MCU_0_RTS: IC1403.14(VOA) ; port FTDI_MCU_0.RTS
FTDI_MCU_0_RX: IC1403.12(VOC) ; port FTDI_MCU_0.RX
FTDI_MCU_0_TX: IC1403.11(VID) ; port FTDI_MCU_0.TX
FTDI_MCU_1_DTR: IC1406.13(VOB) ; port FTDI_MCU_1.DTR
FTDI_MCU_1_RTS: IC1406.14(VOA) ; port FTDI_MCU_1.RTS
FTDI_MCU_1_RX: IC1406.12(VOC) ; port FTDI_MCU_1.RX
FTDI_MCU_1_TX: IC1406.11(VID) ; port FTDI_MCU_1.TX
USB0_FTDI_DTR: IC1402.1(DTR#) IC1403.4(VIB)
USB0_FTDI_RTS: IC1402.2(RTS#) IC1403.3(VIA)
USB0_FTDI_RX: IC1402.4(RXD) IC1403.6(VOD)
USB0_FTDI_TX: IC1402.20(TXD) IC1403.5(VIC)
USB1_FTDI_DTR: IC1405.1(DTR#) IC1406.4(VIB)
USB1_FTDI_RTS: IC1405.2(RTS#) IC1406.3(VIA)
USB1_FTDI_RX: IC1405.4(RXD) IC1406.6(VOD)
USB1_FTDI_TX: IC1405.20(TXD) IC1406.5(VIC)
USB_0_GND_EXT: C1401.2 C1402.2 C1403.2 C1404.2 IC1401.2(GND) IC1402.6(GND) IC1402.16(GND) IC1403.2(GND1) IC1403.8(GND1) R1403.2 R1404.2 TP3.1 X1401.5(GND)
USB_0_VBUS1_EXT: C1401.1 C1402.1 C1403.1 IC1401.5(V) IC1402.15(VCC) IC1403.1(VDD1) IC1403.7(VE1) TP1.1 X1401.1(VBUS)
USB_0_VCC_EXT: C1404.1 IC1402.3(VCCIO) IC1402.13(3V3OUT) IC1402.14(RESET#)
USB_1_GND_EXT: C1406.2 C1407.2 C1408.2 C1409.2 IC1404.2(GND) IC1405.6(GND) IC1405.16(GND) IC1406.2(GND1) IC1406.8(GND1) R1407.2 R1408.2 TP4.1 X1402.5(GND)
USB_1_VBUS1_EXT: C1406.1 C1407.1 C1408.1 IC1404.5(V) IC1405.15(VCC) IC1406.1(VDD1) IC1406.7(VE1) TP2.1 X1402.1(VBUS)
USB_1_VCC_EXT: C1409.1 IC1405.3(VCCIO) IC1405.13(3V3OUT) IC1405.14(RESET#)
NetIC1402_7: IC1402.7(DSR#) R1404.1
NetIC1402_9: IC1402.9(CTS#) R1403.1
NetIC1402_11: IC1402.11(USBDP) R1402.1
NetIC1402_12: IC1402.12(USBDM) R1401.1
NetIC1405_7: IC1405.7(DSR#) R1408.1
NetIC1405_9: IC1405.9(CTS#) R1407.1
NetIC1405_11: IC1405.11(USBDP) R1406.1
NetIC1405_12: IC1405.12(USBDM) R1405.1

Not connected (* = marked no-connect by the designer): IC1401 1(IO1)* 3(IO2)*; IC1402 5(RI#)* 8(DCD#)* 10(CBUS2)* 17(CBUS1)* 18(CBUS0)* 19(CBUS3)*; IC1404 1(IO1)* 3(IO2)*; IC1405 5(RI#)* 8(DCD#)* 10(CBUS2)* 17(CBUS1)* 18(CBUS0)* 19(CBUS3)*; X1401 4(ID)* 6(MP1)* 7(MP2)* 8(MP3)* 9(MP4)*; X1402 4(ID)* 6(MP1)* 7(MP2)* 8(MP3)* 9(MP4)*

### Notes on the sheet
- MCU_0 (primary)
- MCU_1 (secondary)
- (near X1401) Isolated USB-Mini
- (near X1402) Isolated USB-Mini
- Fraunhofer IISB
- Schottkystr. 10
- developed by:
- 91058 Erlangen
- Germany
- Author
- Project
- License
- Description
- File
- Version
- Release Date
- Sheet
- www.foxbms.org
- www.iisb.fraunhofer.de
- foxBMS Team
- /

### Library data of the parts
C1401 C1406 = gen_C_ceramic_4u7_25V_X5R_0603: MLCC; Capacitance: 4u7; Rated Voltage: 25V; Dielectric: X5R; Case EIA: 0603; Case Metric: 1608; AVT Set: x; Automotive Qualified: False; Part Number: gen_C_ceramic_4u7_25V_X5R_0603; Supplier 1: Farnell; Supplier Part Number 1: 2672159
C1402-C1405 C1407-C1410 = gen_C_ceramic_100n_50V_X7R_0603: as C425 on sheet mcu0_primary; Part Number: gen_C_ceramic_100n_50V_X7R_0603; Supplier 1: Farnell; Supplier Part Number 1: 2525267; Supplier 2: Digikey; Supplier Part Number 2: 490-6049-1-ND
IC1401 IC1404 = nxp_IP4220CZ6,125
IP4220CZ6,125: Usb ESD protection diodes; Manufacturer: Nexperia; PnP Package: SOT457; Automotive Qualified: False; Part Number: nxp_IP4220CZ6,125 / IP4220CZ6,125; Part Name: IP4220CZ6,125; Operating Temperature: -40°C - +85°C; ComponentLink1Description: Datasheet; ComponentLink1URL: http://www.farnell.com/datasheets/1708221.pdf; Supplier 1: Farnell; Supplier Part Number 1: 1506629; Supplier 2: Digikey; Supplier Part Number 2: 1727-3578-1-ND; Supplier 3: Mouser; Supplier Part Number 3: 771-IP4220CZ6-T/R
IC1402 IC1405 = CMP-0248-00024-2: USB to Full-Handshake UART Interface Chip, UHCI/OHCI/EHCI Compatible, USB 2.0 Compatible, -40 to +85 degC, 20-Pin SSOP, Pb-Free, Tape and Reel; Manufacturer: FTDI; PackageVersion: Feb-13; PackageReference: SSOP-20; ComponentLink1Description: Manufacturer URL; ComponentLink2Description: Datasheet; PackageDescription: 20-Pin Small Outline Package, 8.6 x 3.9 mm Body, 0.635 mm Pitch; ComponentLink3URL: www.ftdichip.com/Products/ICs/FT231X.html; PartNumber: FT231XS-R; DatasheetVersion: ver 1.2, Feb-2013; ComponentLink2URL: http://www.ftdichip.com/Support/Documents/DataSheets/ICs/DS_FT231X.pdf; Code_JEDEC: MO-137-AD; ComponentLink3Description: FT231X Product Page; RevisionNote: DatasheetVersion updated to 1.2 Feb-2013; ComponentLink1URL: http://www.ftdichip.com/
IC1403 IC1406 = CMP-0534-00405-1: Quad Channel Digital Isolator, Enhanced System-Level ESD Reliability, 2.5 KV rms Insulation Rating, 90 Mbps Data Rate, 32 ns Delay, Industrial, 16-pin SOIC (RW-16), Tube; Manufacturer: Analog Devices; Insulation Rating (kVrms): 2.5; Max Data Rate: 90Mbps; PackageDescription: 16-Pin Standard Small Outline Package, Body 10.3 x 7.5 mm, Pitch 1.27 mm; ComponentLink2Description: Datasheet; Mounting Technology: Surface Mount; ComponentLink2URL: http://www.analog.com/static/imported-files/data_sheets/ADUM3400_3401_3402.pdf; ComponentLink4URL: Product URL:http://www.analog.com/en/interface-isolation/digital-isolators/adum3401/products/product.html; ComponentLink1URL: http://www.analog.com/en/index.html; ComponentLink1Description: Manufacturer URL; Max Operating Temp (degreesC): 105; PartNumber: ADUM3401CRWZ; Code_JEDEC: MS-013-AA; PackageVersion: 032707-B, 03/2007; ComponentLink3URL: http://www.analog.com/static/imported-files/packages/PKG_PDF/SOIC_WIDE%20%28RW%29/RW_16.pdf; DatasheetVersion: Rev. B; PackageReference: RW-16; ComponentLink4Description: URL Link1; ComponentLink3Description: Package Specification
R1401 R1402 R1405 R1406 = gen_R_27R_0603: SMD Resistor 27R 0603; Tolerance: 1%; Power: 0.1W; Case EIA: 0603; Case Metric: 1608; Maximum Working Voltage: 75V; PnP Package: R_0603; Automotive Qualified: False; Part Number: gen_R_27R_0603; Operating Temperature: -55°C - +155°C; Resistance: 27R; Series: E24; PnP Value: 27R; Supplier 1: Farnell; Supplier Part Number 1: 2059559
R1403 R1404 = gen_R_0R_0603: as R403 on sheet mcu0_primary; Part Number: gen_R_0R_0603; Operating Temperature: -55°C - +155°C; Resistance: 0R; Series: Jumper; PnP Value: 0R; Supplier 1: Farnell; Supplier Part Number 1: 2073345
R1407 R1408 = gen_R_0R_0603: SMD Resistor 0R 0603; Power: 0.1W; Case EIA: 0603; Case Metric: 1608; Maximum Working Voltage: 75V; PnP Package: R_0603; Automotive Qualified: False; Part Number: gen_R_0R_0603; Operating Temperature: -55°C - +155°C; Resistance: 0R; Series: Jumper; PnP Value: 0R; Supplier 1: Farnell; Supplier Part Number 1: 2073345
TP1-TP4 = Testpoint_Square: Testpoint, square; Part Number: Testpoint_Square
X1401 X1402 = CMP-0411-00002-1: USB, MINI, SMD, RA KME04-USBMU03A01; Manufacturer: Molex; ComponentLink1URL: http://www.molex.com/; PartNumber: 67503-1020; Mounting Technology: Surface Mount; ComponentLink1Description: Manufacturer URL; Terminal Pitch: 0.8 mm; DatasheetVersion: Rev F, 06/2009; ComponentLink2Description: Datasheet; PackageDescription: Mini USB Connector, SMT, Righer Angle; ComponentLink2URL: http://www.molex.com/pdm_docs/sd/675031020_sd.pdf; PackageReference: 67503-1020